# EAGLE schematic Dashboard Test External rev0 (EAGLE 7.6.0)
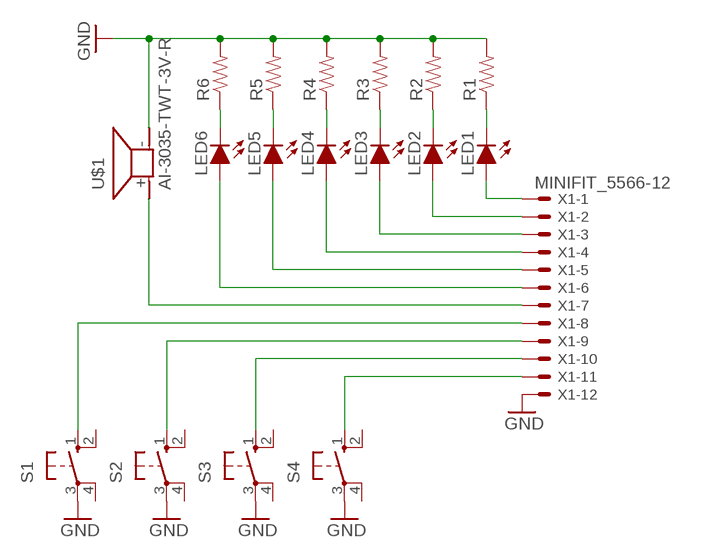
[diagram p0: schematic, sheet 1]

## Parts
LED1  LED-5MM  [LED-5MM]
LED2  LED-5MM  [LED-5MM]
LED3  LED-5MM  [LED-5MM]
LED4  LED-5MM  [LED-5MM]
LED5  LED-5MM  [LED-5MM]
LED6  LED-5MM  [LED-5MM]
R1  RESISTOREZ  [AXIAL-0.3EZ]
R2  RESISTOREZ  [AXIAL-0.3EZ]
R3  RESISTOREZ  [AXIAL-0.3EZ]
R4  RESISTOREZ  [AXIAL-0.3EZ]
R5  RESISTOREZ  [AXIAL-0.3EZ]
R6  RESISTOREZ  [AXIAL-0.3EZ]
S1  BTN_10-XX  [B3F-10XX]
S2  BTN_10-XX  [B3F-10XX]
S3  BTN_10-XX  [B3F-10XX]
S4  BTN_10-XX  [B3F-10XX]
U$1  AI-3035-TWT-3V-R  [AI-3035-TWT-3V-R]
X1  MINIFIT_5566-12  [MINIFIT_5566-12]

## Nets
GND: R1.P$2 R2.P$2 R3.P$2 R4.P$2 R5.P$2 R6.P$2 S1.3(P) S2.3(P) S3.3(P) S4.3(P) U$1.P$2 X1.12
N$1: S1.1(S) X1.8
N$2: S2.1(S) X1.9
N$3: S3.1(S) X1.10
N$4: S4.1(S) X1.11
N$5: U$1.P$1 X1.7
N$6: LED6.A X1.6
N$7: LED5.A X1.5
N$8: LED4.A X1.4
N$9: LED3.A X1.3
N$10: LED2.A X1.2
N$11: LED1.A X1.1
N$12: LED1.K(C) R1.P$1
N$13: LED2.K(C) R2.P$1
N$14: LED3.K(C) R3.P$1
N$15: LED4.K(C) R4.P$1
N$16: LED5.K(C) R5.P$1
N$17: LED6.K(C) R6.P$1
Unconnected: S1.2(S1) S1.4(P1) S2.2(S1) S2.4(P1) S3.2(S1) S3.4(P1) S4.2(S1) S4.4(P1)

## Library data of the parts
LED1-LED6 = HyTechDevices:LED: Light Emitting Diode (LED) Source: Dangerous Prototypes Eagle Library <https://github.com/DangerousPrototypes/Eagle_Part_Library>
R1-R6 = HyTechDevices:RESISTOR: Resistor Basic schematic elements and footprints for 0603, 1206, and PTH resistors.
S1-S4 = HyTechDevices:BTN_10-XX: OMRON SWITCH Momentary button; MPN: B3F-1000; OC_FARNELL: 176432; OC_NEWARK: 36M3542
U$1 = HyTechDevices:AI-3035-TWT-3V-R: 30mm audible indicator buzzer - 100 dBA minimum output (3VDC @ 10 cm) and 3,500 Hz continuous tone
X1 = HyTechDevices:MINIFIT_5566-12: Mini-Fit Junior connector 12 pole Source: http://www.molex.com; OC_FARNELL: unknown; OC_NEWARK: unknown